# EAGLE design Single-Channel-OpAmp_V1 (EAGLE 6.4)
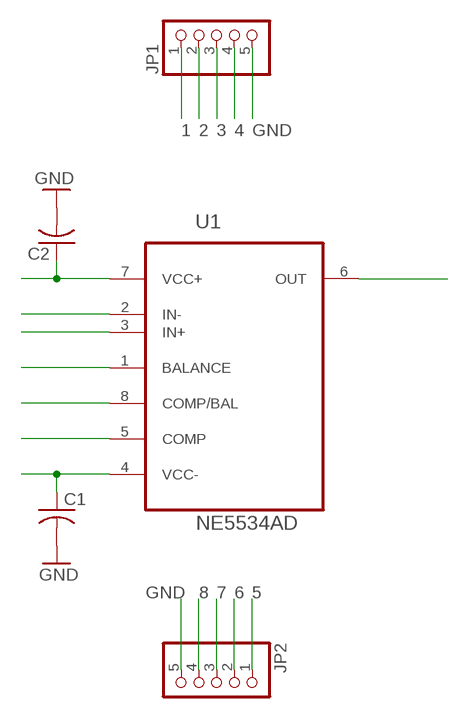
[diagram p0: schematic, sheet 1]

## Parts
C1  C-USC0805  [C0805]
C2  C-USC0805  [C0805]
JP1  PINHD-1X5  [1X05]
JP2  PINHD-1X5  [1X05]
U1  NE5534AD  [SOIC127P600X175-8N]

## Nets
1: JP1.1 U1.1(BALANCE)
2: JP1.2 U1.2(IN-)
3: JP1.3 U1.3(IN+)
4: C1.1 JP1.4 U1.4(VCC-)
5: JP2.1 U1.5(COMP)
6: JP2.2 U1.6(OUT)
7: C2.1 JP2.3 U1.7(VCC+)
8: JP2.4 U1.8(COMP/BAL)
GND: C1.2 C2.2 JP1.5 JP2.5

## Library data of the parts
C1 C2 = rcl:C-US: CAPACITOR, American symbol
JP1 JP2 = pinhead:PINHD-1X5: PIN HEADER
U1 = Texas Instruments_By_element14_Batch_1:NE5534AD: LOW-NOISE OPERATIONAL AMPLIFIERS; MPN: NE5534AD; OC_FARNELL: 9589864; OC_NEWARK: 08F2508; PACKAGE: SOIC-8; SUPPLIER: Texas Instruments

## Board
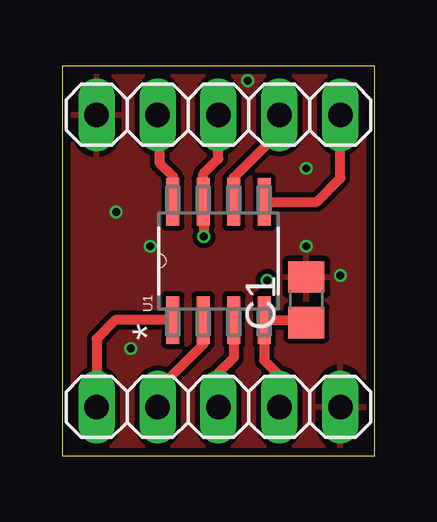
[diagram p1: board, top side]
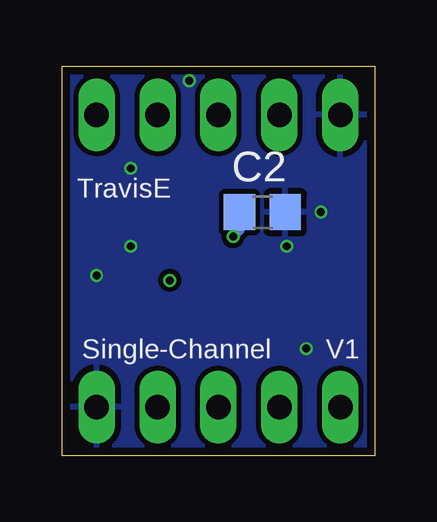
[diagram p2: board, bottom side, seen from below]

Size 13 x 16.26 mm. Coordinates in mm from the lower left corner, seen from the top.
Outline: 0,0 13.01,0 13.01,16.26 0,16.26 0,0
Copper layers (1*16): Top 0.035mm / dielectric 1.5mm / Bottom 0.035mm
Design rules "default *": minimum track width 10mil, minimum drill 24mil, track to track 8mil, track to pad 8mil, pad to pad 8mil, via to via 8mil, smd to smd 8mil, copper to edge 13mil, drill to drill 8mil, minimum pad ring 8mil, minimum via ring 4mil, stop-mask expansion 4mil, vias tented up to drill 14mil, thermal gap 10mil

### Footprints (pad centres in the part's own frame; a part is rotated, then mirrored left to right if it is on the bottom)
C0805 = smd 1.3 x 1.5: 1 -0.95,0; 2 0.95,0
1X05 = drill 1.016 long: 1 -5.08,0; 2 -2.54,0; 3 0,0; 4 2.54,0; 5 5.08,0
SOIC127P600X175-8N = smd 1.981 x 0.559: 1 -2.464,1.905; 2 -2.464,0.635; 3 -2.464,-0.635; 4 -2.464,-1.905; 5 2.464,-1.905; 6 2.464,-0.635; 7 2.464,0.635; 8 2.464,1.905

### Placement (x,y rotation side)
C1  10.16,6.5 90 top
C2  4.67,10.16 0 bottom
JP1  6.5,2.03 0 top
JP2  6.5,14.22 180 top
U1  6.5,8.13 90 top

### Tracks (layer width: path | path; a pad name or v marks a point on that pad's centre or on a via)
1
  Top 0.406: U1.1 2.21,5.66 1.42,4.88 JP1.1
2
  Top 0.406: U1.2 5.87,4.65 4.27,3.05 4.27,2.34 JP1.2
3
  Top 0.406: U1.3 7.14,4.09 6.5,3.45 JP1.3
4
  Top 0.406: C1.1 10.05,5.66 U1.4 8.41,3.99 9.04,3.35 JP1.4
5
  Top 0.406: U1.5 10.59,10.59 11.58,11.58 JP2.1
6
  Top 0.406: U1.6 7.14,11.61 8.74,13.21 8.74,13.92 JP2.2
7  (via drill 0.33)
  Top 0.406: JP2.3 6.5,12.4 5.87,11.76 U1.7 5.89,10.59 v5.89,9.14
  Bottom 0.406: C2.1 5.62,9.41 v5.89,9.14
8
  Top 0.406: U1.8 4.6,11.66 4.06,12.19 4.06,14.12 JP2.4
GND  (via drill 0.33)
  other vias: 10.16,8.74 11.58,7.52 10.16,11.99 2.84,4.47 7.72,15.65 2.24,10.16 3.66,8.74
  pour Bottom: 0.41,15.85 12.6,15.85 12.6,0.41 0.41,0.41
  pour Top: 0.41,15.85 12.6,15.85 12.6,0.41 0.41,0.41
N$1  (via drill 0.33)
  other vias: 8.53,7.32

### Text on the board
bPlace: TravisE | V1 | Single-Channel